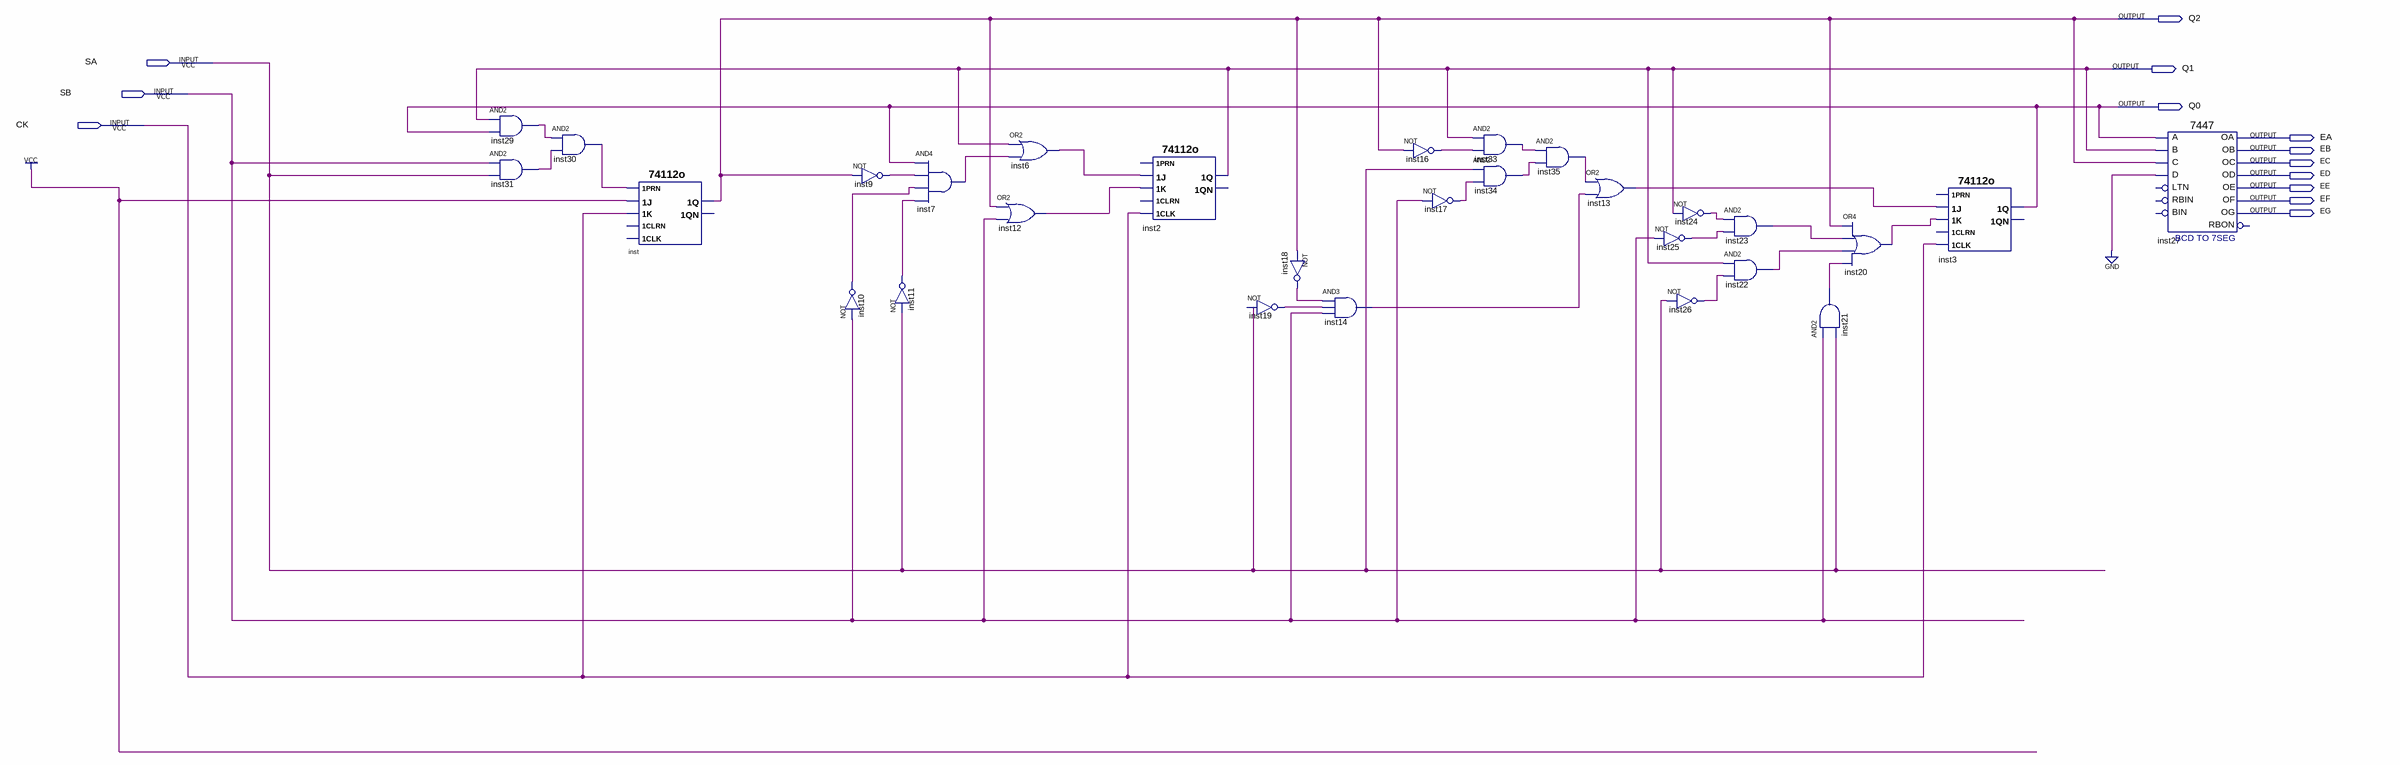
[diagram p0: schematic sheet]
// Quartus schematic estacionamento.bdf as structural Verilog: 29 symbols, 13 pins
module estacionamento (
  input  SA,
  input  SB,
  input  CK,
  output Q2,
  output Q1,
  output Q0,
  output EA,
  output EB,
  output EC,
  output ED,
  output EE,
  output EF,
  output EG
);

  wire inst6_out, inst7_out, inst9_out, inst10_out, inst11_out, inst12_out, inst13_out, inst14_out,
       inst16_out, inst17_out, inst18_out, inst19_out, inst20_out, inst21_out, inst22_out, inst23_out,
       inst24_out, inst25_out, inst26_out, inst29_out, inst30_out, inst31_out, inst33_out, inst34_out,
       inst35_out;

  and inst29 (inst29_out, Q1, Q0);
  and inst31 (inst31_out, SB, SA);
  and inst30 (inst30_out, inst29_out, inst31_out);
  \74112o  inst (.\1PRN (inst30_out), .\1J (1'b1), .\1K (CK), .\1Q (Q2));  // open: 1CLK, 1CLRN, 1QN
  not inst9 (inst9_out, Q2);
  not inst10 (inst10_out, SB);
  and inst7 (inst7_out, Q0, inst9_out, inst10_out, inst11_out);
  not inst11 (inst11_out, SA);
  or inst6 (inst6_out, Q1, inst7_out);
  or inst12 (inst12_out, Q2, SB);
  \74112o  inst2 (.\1CLK (CK), .\1J (inst6_out), .\1K (inst12_out), .\1Q (Q1));  // open: 1PRN, 1CLRN, 1QN
  not inst19 (inst19_out, SA);
  not inst18 (inst18_out, Q2);
  and inst14 (inst14_out, inst18_out, inst19_out, SB);
  not inst16 (inst16_out, Q2);
  not inst17 (inst17_out, SB);
  and inst33 (inst33_out, Q1, inst16_out);
  and inst34 (inst34_out, SA, inst17_out);
  and inst35 (inst35_out, inst33_out, inst34_out);
  or inst13 (inst13_out, inst35_out, inst14_out);
  not inst25 (inst25_out, SB);
  not inst26 (inst26_out, SA);
  not inst24 (inst24_out, Q1);
  and inst23 (inst23_out, inst24_out, inst25_out);
  and inst22 (inst22_out, Q1, inst26_out);
  and inst21 (inst21_out, SB, SA);
  or inst20 (inst20_out, Q2, inst23_out, inst22_out, inst21_out);
  \74112o  inst3 (.\1CLK (CK), .\1J (inst13_out), .\1K (inst20_out), .\1Q (Q0));  // open: 1PRN, 1CLRN, 1QN
  \7447  inst27 (
    .B(Q1), .C(Q2), .D(1'b0), .A(Q0), .OB(EB), .OC(EC), .OE(EE), .OD(ED), .OF(EF), .OG(EG), .OA(EA));  // open: LTN, RBIN, BIN, RBON
endmodule
